# EasyEDA schematic 1-Schematic_Final project.json
TITLE: Sheet_1; REV: 1.0; Date: 2023-11-16; Sheet: 1/1; Drawn By: collejoulian; Company: Your Company
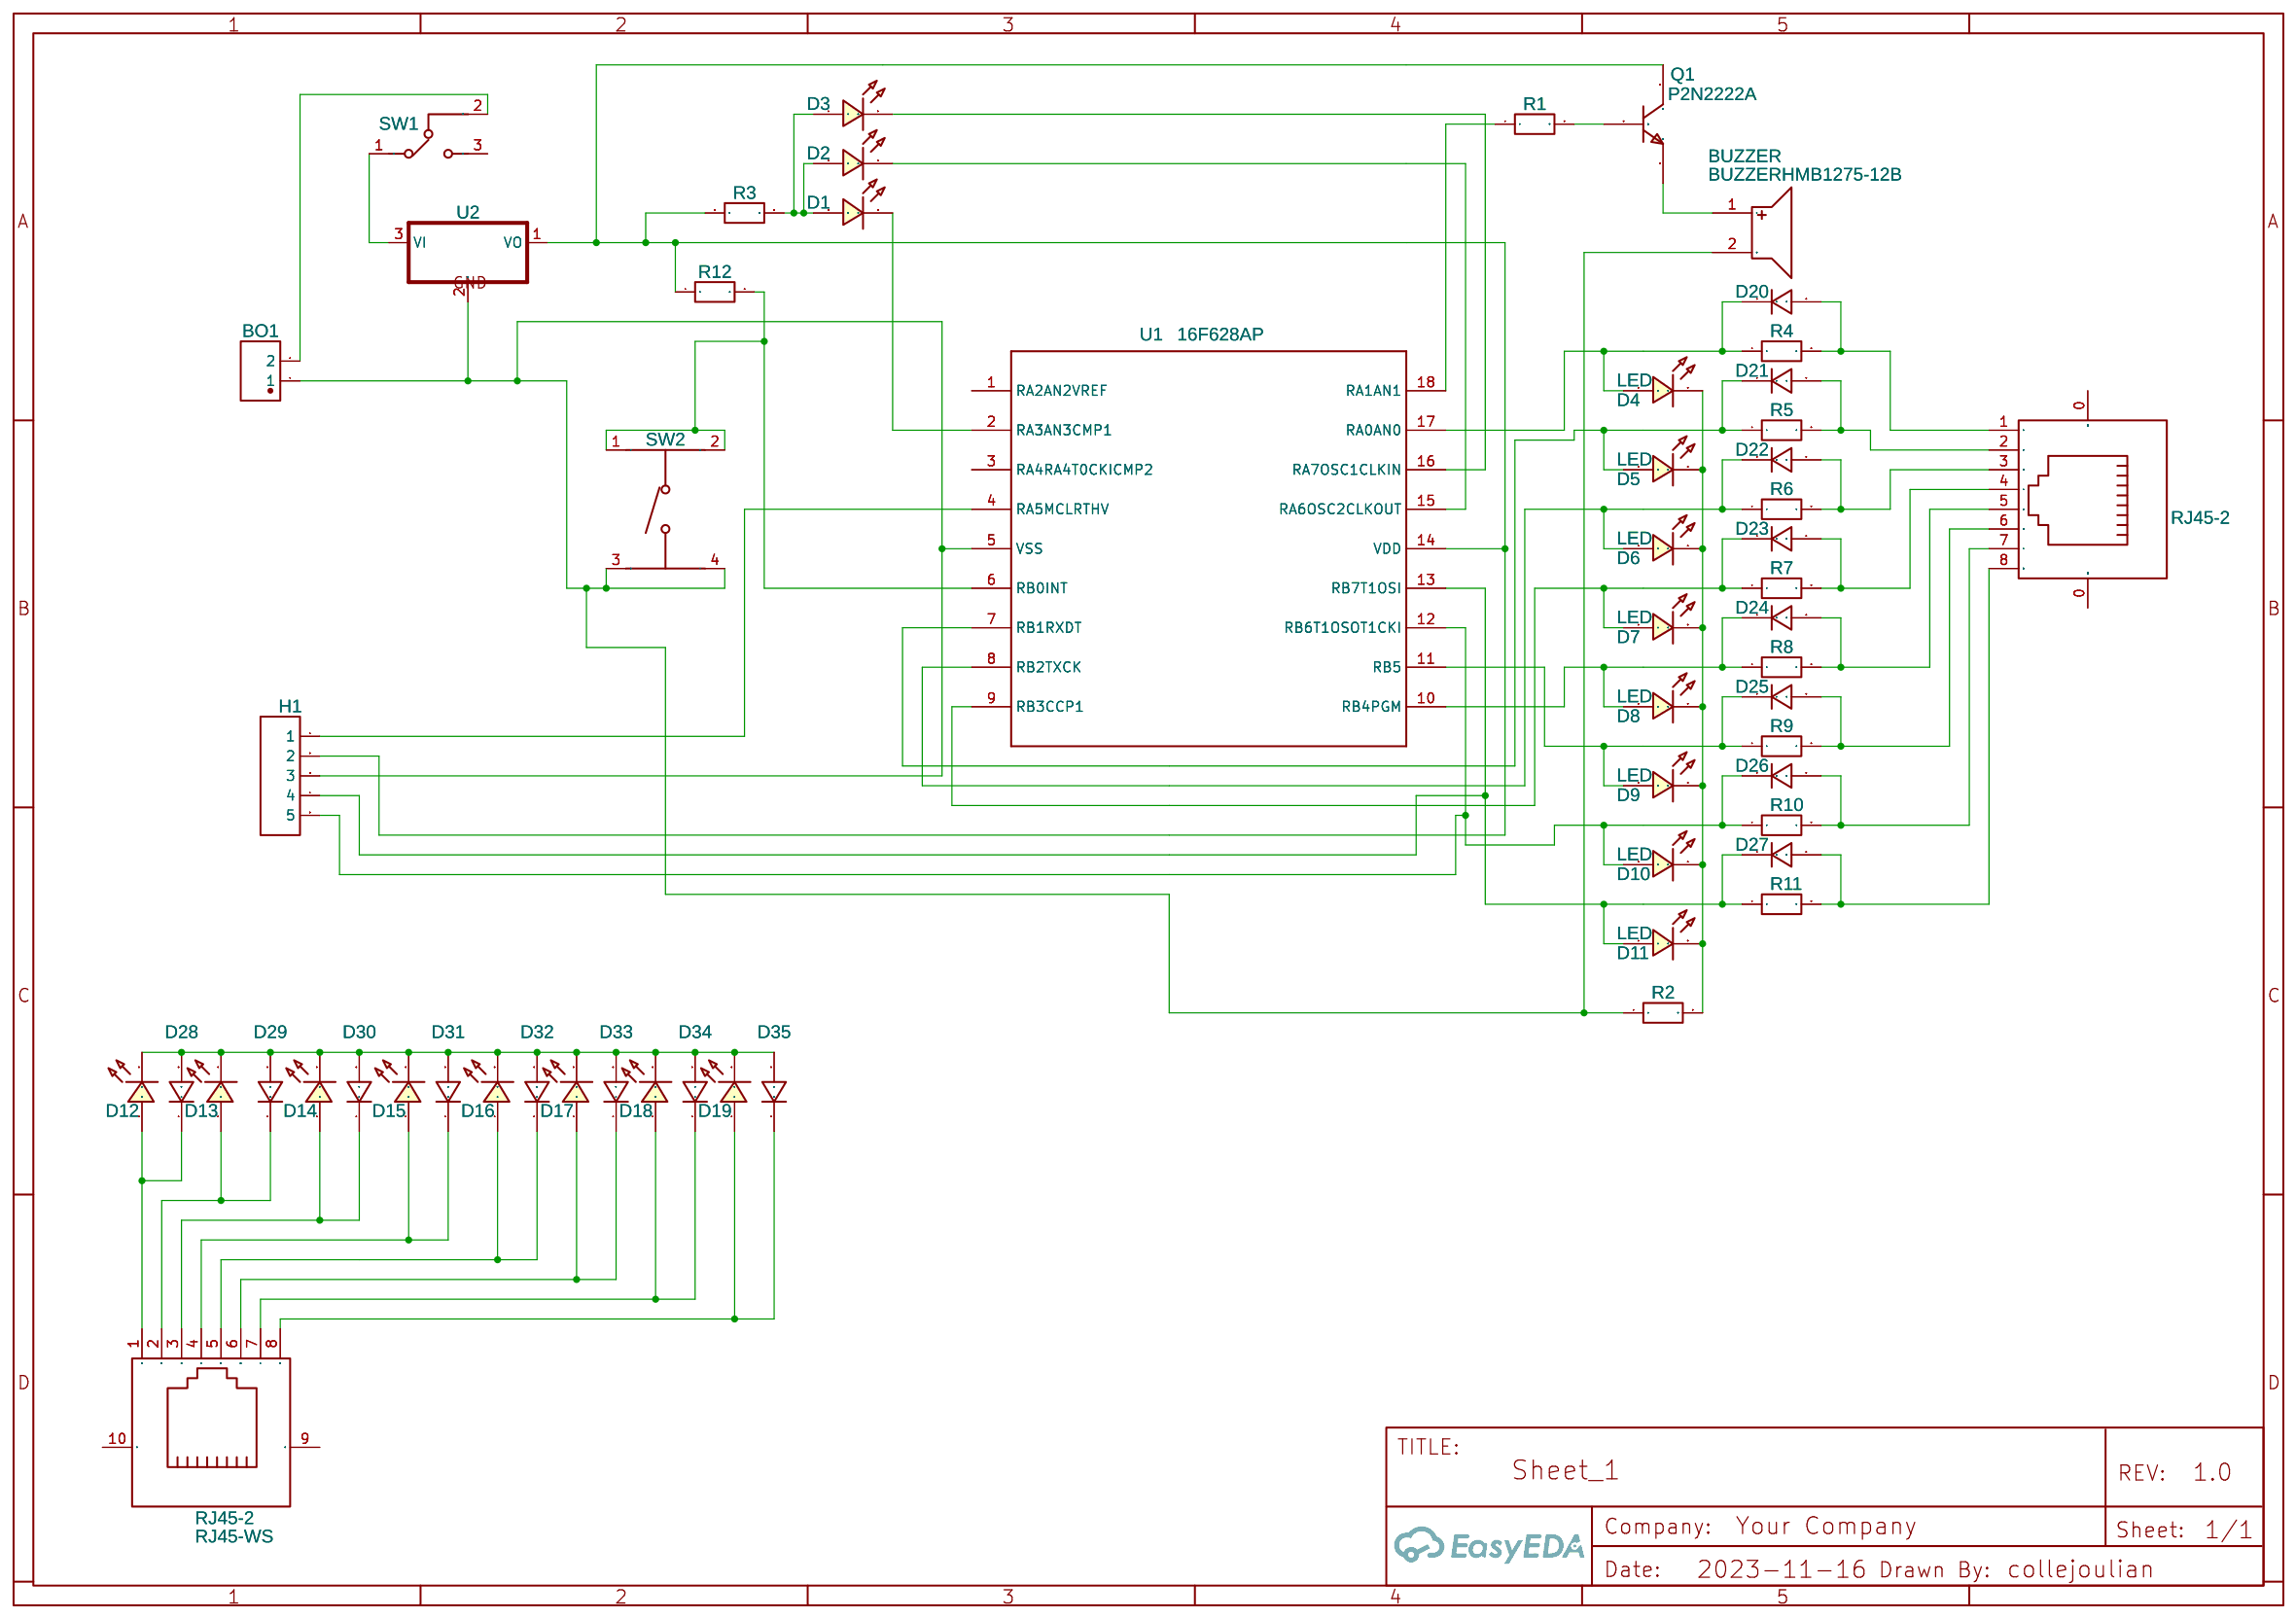
[diagram p0: schematic sheet]

## Parts
BO1  BV-2P-5mm  [BORNIER A VIS 2P - 5MM]
BUZZER  BUZZERHMB1275-12B  [DIP-BUZZER-12X7.5]
D1  D1  [LED-TH_BD3.0_RED]
D2  D2  [LED-TH_BD3.0_RED]
D3  D3  [LED-TH_BD3.0_RED]
D4  LED  [LED-TH_BD3.0_RED]
D5  LED  [LED-TH_BD3.0_RED]
D6  LED  [LED-TH_BD3.0_RED]
D7  LED  [LED-TH_BD3.0_RED]
D8  LED  [LED-TH_BD3.0_RED]
D9  LED  [LED-TH_BD3.0_RED]
D10  LED  [LED-TH_BD3.0_RED]
D11  LED  [LED-TH_BD3.0_RED]
D12  D12  [LED-TH_BD3.0_RED]
D13  D13  [LED-TH_BD3.0_RED]
D14  D14  [LED-TH_BD3.0_RED]
D15  D15  [LED-TH_BD3.0_RED]
D16  D16  [LED-TH_BD3.0_RED]
D17  D17  [LED-TH_BD3.0_RED]
D18  D18  [LED-TH_BD3.0_RED]
D19  D19  [LED-TH_BD3.0_RED]
D20  D  [DO-35_BD2.0-L4.2-P8.20-D0.5-RD]
D21  D  [DO-35_BD2.0-L4.2-P8.20-D0.5-RD]
D22  D  [DO-35_BD2.0-L4.2-P8.20-D0.5-RD]
D23  D  [DO-35_BD2.0-L4.2-P8.20-D0.5-RD]
D24  D  [DO-35_BD2.0-L4.2-P8.20-D0.5-RD]
D25  D  [DO-35_BD2.0-L4.2-P8.20-D0.5-RD]
D26  D  [DO-35_BD2.0-L4.2-P8.20-D0.5-RD]
D27  D  [DO-35_BD2.0-L4.2-P8.20-D0.5-RD]
D28  D28  [DO-35_BD2.0-L4.2-P8.20-D0.5-RD]
D29  D29  [DO-35_BD2.0-L4.2-P8.20-D0.5-RD]
D30  D30  [DO-35_BD2.0-L4.2-P8.20-D0.5-RD]
D31  D31  [DO-35_BD2.0-L4.2-P8.20-D0.5-RD]
D32  D32  [DO-35_BD2.0-L4.2-P8.20-D0.5-RD]
D33  D33  [DO-35_BD2.0-L4.2-P8.20-D0.5-RD]
D34  D34  [DO-35_BD2.0-L4.2-P8.20-D0.5-RD]
D35  D35  [DO-35_BD2.0-L4.2-P8.20-D0.5-RD]
H1  1z2  [HDR-TH_5P-P2.54-V-F]
Q1  P2N2222A  [TO92-INLINE]
R1  1k  [R_AXIAL-0.3]
R2  1k  [R_AXIAL-0.3]
R3  1k  [R_AXIAL-0.3]
R4  1k  [R_AXIAL-0.3]
R5  1k  [R_AXIAL-0.3]
R6  1k  [R_AXIAL-0.3]
R7  1k  [R_AXIAL-0.3]
R8  1k  [R_AXIAL-0.3]
R9  1k  [R_AXIAL-0.3]
R10  1k  [R_AXIAL-0.3]
R11  1k  [R_AXIAL-0.3]
R12  1k  [R_AXIAL-0.3]
RJ45  RJ45-2  [RJ45-TH_DS1128-04]
RJ45-2  RJ45-WS  [RJ45-TH_FRJ45004-1100K6K02C0]
SW1  SW1  [SW-TH_1101M2S3CQE2]
SW2  TS-1102-5016  [SW-TH_4P-L6.0-W6.0-P3.90-LS6.5]
U1  16F628AP  [DIP18]
U2  7805L  [TO92]

## Library data of the parts
BO1 = Bornier A Vis 2P - 5mm: Supplier: LCSC; Supplier Part: C474881; Manufacturer: Cixi Kefa Elec; Manufacturer Part: KF301-5.0-2P; Contributor: LCSC
BUZZER = BUZZERHMB1275-12B: Supplier: LCSC; Manufacturer: HNDZ; Manufacturer Part: buzzerHMB1275-12B; Contributor: LCSC; Supplier Part: C96094
D1-D19 = LED-TH-3mm_R: Manufacturer: EVERLIGHT(台湾亿光); Manufacturer Part: 204-10SDRD/S530-A3-L; Supplier Part: C84774; Supplier: LCSC; Contributor: LCEDA_Lib
D20-D35 = 1N4148: Supplier: LCSC; Supplier Part: C13769; Manufacturer: STMicroelectronics; Contributor: LCSC
H1 = Header-Female-2.54_1x5: Supplier: LCSC; Manufacturer: BOOMELE(博穆精密); Manufacturer Part: 2.54-1*5P母; Supplier Part: C50950; JLCPCB Part Class: Extended Part; link: https://lcsc.com/eda_search?q=C50950&%26type=1&ref=editor
Q1 = P2N2222A: Amplifier Transistor NPN Silicon
R1-R12 = R_AXIAL-0.3_EU: Contributor: LCEDA_Lib
RJ45 = DS1128-04-S8B8P-X: Supplier: LCSC; Manufacturer: CONNFLY; Supplier Part: C86576; JLCPCB Part Class: Extended Part; link: https://lcsc.com/eda_search?q=C86576&%26type=1&ref=editor
RJ45-2 = FRJ45004-1100K6K02C0: Contributor: LCSC; Supplier: LCSC; Supplier Part: C456366; Manufacturer: TXGA(特思嘉); JLCPCB Part Class: Extended Part; link: https://lcsc.com/eda_search?q=C456366&%26type=1&ref=editor
SW1 = 1101M2S3CQE2: Supplier: LCSC; Supplier Part: C221538; Manufacturer: C&K; Contributor: hugoforet25; JLCPCB Part Class: Extended Part
SW2 = TS-1102-5016: Contributor: LCSC; Supplier: LCSC; Supplier Part: C111609; Manufacturer: SOFNG(硕方); JLCPCB Part Class: Extended Part; link: https://lcsc.com/eda_search?q=C111609&%26type=1&ref=editor
U1 = 16F628AP
U2 = 7805L: Positive VOLTAGE REGULATOR; Contributor: Adafruit

## Nets
Net-(BO1-1): BO1.1 BUZZER.2 H1.3 R2.1 SW2.3 SW2.4 U1.5(VSS) U2.2(GND)
Net-(BO1-2): BO1.2 SW1.2
Net-(BUZZER-1): BUZZER.1 Q1.3(E)
Net-(D1-1): D1.1 D2.1 D3.1 R3.2
Net-(D1-2): D1.2 U1.2(RA3AN3CMP1)
Net-(D2-2): D2.2 U1.15(RA6OSC2CLKOUT)
Net-(D3-2): D3.2 U1.16(RA7OSC1CLKIN)
Net-(D4-1): D4.1 D20.1 R4.1 U1.17(RA0AN0)
Net-(D4-2): D4.2 D5.2 D6.2 D7.2 D8.2 D9.2 D10.2 D11.2 R2.2
Net-(D5-1): D5.1 D21.1 R5.1 U1.7(RB1RXDT)
Net-(D6-1): D6.1 D22.1 R6.1 U1.8(RB2TXCK)
Net-(D7-1): D7.1 D23.1 R7.1 U1.9(RB3CCP1)
Net-(D8-1): D8.1 D24.1 R8.1 U1.10(RB4PGM)
Net-(D9-1): D9.1 D25.1 R9.1 U1.11(RB5)
Net-(D10-1): D10.1 D26.1 H1.5 R10.1 U1.12(RB6T1OSOT1CKI)
Net-(D11-1): D11.1 D27.1 H1.4 R11.1 U1.13(RB7T1OSI)
Net-(D12-1): D12.1 D28.1 RJ45-2.1
Net-(D12-2): D12.2 D13.2 D14.2 D15.2 D16.2 D17.2 D18.2 D19.2 D28.2 D29.2 D30.2 D31.2 D32.2 D33.2 D34.2 D35.2
Net-(D13-1): D13.1 D29.1 RJ45-2.2
Net-(D14-1): D14.1 D30.1 RJ45-2.3
Net-(D15-1): D15.1 D31.1 RJ45-2.4
Net-(D16-1): D16.1 D32.1 RJ45-2.5
Net-(D17-1): D17.1 D33.1 RJ45-2.6
Net-(D18-1): D18.1 D34.1 RJ45-2.7
Net-(D19-1): D19.1 D35.1 RJ45-2.8
Net-(D20-2): D20.2 R4.2 RJ45.1
Net-(D21-2): D21.2 R5.2 RJ45.2
Net-(D22-2): D22.2 R6.2 RJ45.3
Net-(D23-2): D23.2 R7.2 RJ45.4
Net-(D24-2): D24.2 R8.2 RJ45.5
Net-(D25-2): D25.2 R9.2 RJ45.6
Net-(D26-2): D26.2 R10.2 RJ45.7
Net-(D27-2): D27.2 R11.2 RJ45.8
Net-(H1-1): H1.1 U1.4(RA5MCLRTHV)
Net-(H1-2): H1.2 Q1.1(C) R3.1 R12.1 U1.14(VDD) U2.1(VO)
Net-(Q1-2): Q1.2(B) R1.2
Net-(R1-1): R1.1 U1.18(RA1AN1)
Net-(R12-2): R12.2 SW2.1 SW2.2 U1.6(RB0INT)
Net-(SW1-1): SW1.1 U2.3(VI)

Not connected (* = marked no-connect by the designer): RJ45 0(SHIELD); RJ45-2 9(EH) 10(EH); SW1 3; U1 1(RA2AN2VREF) 3(RA4RA4T0CKICMP2)
